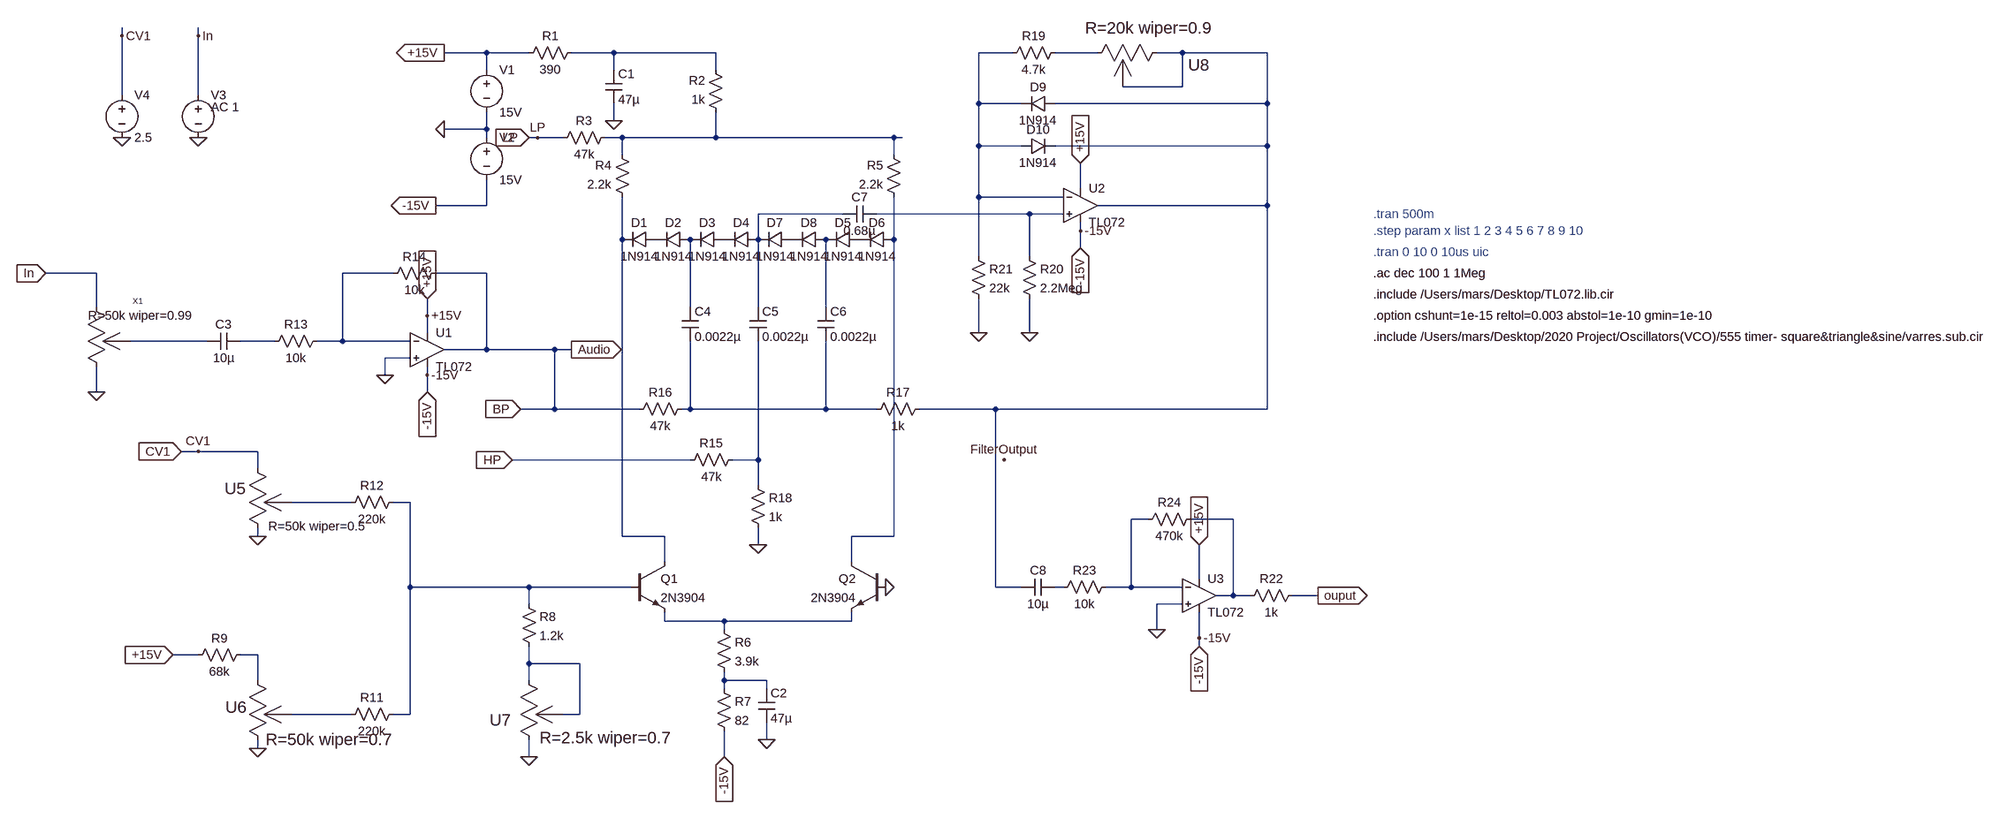
[diagram p0: schematic VCF.asc]
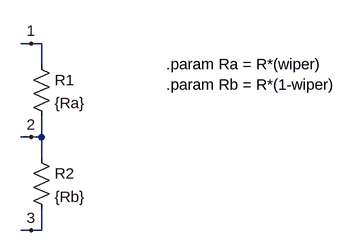
[diagram p1: sub-circuit varres.asc]
VCF.asc, the LTspice schematic file:
Version 4
SHEET 1 3112 2688
WIRE -512 48 -512 32
WIRE -368 48 -368 32
WIRE 176 80 96 80
WIRE 256 80 176 80
WIRE 416 80 336 80
WIRE 608 80 416 80
WIRE 1168 80 1104 80
WIRE 1328 80 1248 80
WIRE 1488 80 1440 80
WIRE 1648 80 1488 80
WIRE 176 112 176 80
WIRE 416 112 416 80
WIRE 608 112 608 80
WIRE 1488 144 1488 80
WIRE 1488 144 1376 144
WIRE -512 160 -512 48
WIRE -368 160 -368 48
WIRE 1104 176 1104 80
WIRE 1184 176 1104 176
WIRE 1648 176 1648 80
WIRE 1648 176 1248 176
WIRE 416 208 416 176
WIRE 176 224 176 192
WIRE 176 224 96 224
WIRE 176 240 176 224
WIRE 272 240 256 240
WIRE 320 240 272 240
WIRE 432 240 400 240
WIRE 608 240 608 192
WIRE 608 240 432 240
WIRE 944 240 608 240
WIRE 960 240 944 240
WIRE 1104 256 1104 176
WIRE 1184 256 1104 256
WIRE 1648 256 1648 176
WIRE 1648 256 1248 256
WIRE 432 272 432 240
WIRE 944 272 944 240
WIRE 1296 336 1296 288
WIRE 1104 352 1104 256
WIRE 1264 352 1104 352
WIRE 176 368 176 320
WIRE 176 368 80 368
WIRE 1648 368 1648 256
WIRE 1648 368 1328 368
WIRE 848 384 688 384
WIRE 1200 384 912 384
WIRE 1264 384 1200 384
WIRE 1296 416 1296 400
WIRE 432 432 432 352
WIRE 688 432 688 384
WIRE 944 432 944 352
WIRE 1296 448 1296 416
WIRE 1104 464 1104 352
WIRE 1200 464 1200 384
WIRE -560 496 -656 496
WIRE 0 496 -96 496
WIRE 176 496 80 496
WIRE -560 560 -560 496
WIRE 560 560 560 432
WIRE 688 560 688 432
WIRE 816 560 816 432
WIRE 64 576 64 544
WIRE 64 608 64 576
WIRE 1104 608 1104 544
WIRE 1200 608 1200 544
WIRE -352 624 -496 624
WIRE -224 624 -288 624
WIRE -96 624 -96 496
WIRE -96 624 -144 624
WIRE 32 624 -96 624
WIRE 176 640 176 496
WIRE 176 640 96 640
WIRE 304 640 176 640
WIRE 336 640 304 640
WIRE 32 656 -16 656
WIRE -16 688 -16 656
WIRE 64 688 64 672
WIRE -560 720 -560 672
WIRE 64 720 64 688
WIRE 304 752 304 640
WIRE 304 752 240 752
WIRE 464 752 304 752
WIRE 560 752 560 624
WIRE 560 752 544 752
WIRE 816 752 816 624
WIRE 816 752 560 752
WIRE 912 752 816 752
WIRE 1136 752 992 752
WIRE 1648 752 1648 368
WIRE 1648 752 1136 752
WIRE -368 832 -400 832
WIRE -256 832 -368 832
WIRE 560 848 224 848
WIRE 688 848 688 624
WIRE 688 848 640 848
WIRE -256 864 -256 832
WIRE 688 896 688 848
WIRE -80 928 -192 928
WIRE 32 928 0 928
WIRE 1424 960 1392 960
WIRE 1584 960 1504 960
WIRE -256 992 -256 976
WIRE 432 992 432 432
WIRE 512 992 432 992
WIRE 944 992 944 432
WIRE 944 992 864 992
WIRE 688 1008 688 976
WIRE 512 1040 512 992
WIRE 864 1040 864 992
WIRE 1520 1072 1520 1008
WIRE 32 1088 32 928
WIRE 256 1088 32 1088
WIRE 448 1088 256 1088
WIRE 1136 1088 1136 752
WIRE 1184 1088 1136 1088
WIRE 1264 1088 1248 1088
WIRE 1392 1088 1392 960
WIRE 1392 1088 1344 1088
WIRE 1488 1088 1392 1088
WIRE 1584 1104 1584 960
WIRE 1584 1104 1552 1104
WIRE 1616 1104 1584 1104
WIRE 1744 1104 1696 1104
WIRE 256 1120 256 1088
WIRE 1488 1120 1440 1120
WIRE 512 1152 512 1136
WIRE 624 1152 512 1152
WIRE 864 1152 864 1136
WIRE 864 1152 624 1152
WIRE 624 1168 624 1152
WIRE 1440 1168 1440 1120
WIRE 1520 1184 1520 1136
WIRE 1520 1200 1520 1184
WIRE -368 1216 -416 1216
WIRE -256 1216 -288 1216
WIRE 256 1232 256 1200
WIRE 352 1232 256 1232
WIRE -256 1264 -256 1216
WIRE 256 1264 256 1232
WIRE 624 1264 624 1248
WIRE 704 1264 624 1264
WIRE 624 1280 624 1264
WIRE 704 1280 704 1264
WIRE -80 1328 -192 1328
WIRE 32 1328 32 1088
WIRE 32 1328 0 1328
WIRE 352 1328 352 1232
WIRE 352 1328 320 1328
WIRE 704 1376 704 1344
WIRE -256 1392 -256 1376
WIRE 256 1408 256 1376
WIRE 624 1408 624 1360
FLAG 416 208 0
FLAG 96 224 0
FLAG 624 1408 -15V
IOPIN 624 1408 In
FLAG 704 1376 0
FLAG 928 1088 0
FLAG 256 1408 0
FLAG -256 992 0
FLAG -256 1392 0
FLAG -416 1216 +15V
IOPIN -416 1216 In
FLAG -368 832 CV1
FLAG -16 688 0
FLAG -656 496 In
IOPIN -656 496 In
FLAG -560 720 0
FLAG 64 576 +15V
FLAG 64 688 -15V
FLAG 336 640 Audio
IOPIN 336 640 Out
FLAG 272 240 LP
FLAG 688 1008 0
FLAG 240 752 BP
IOPIN 240 752 In
FLAG 224 848 HP
IOPIN 224 848 In
FLAG 1104 608 0
FLAG 1200 608 0
FLAG 1744 1104 ouput
IOPIN 1744 1104 Out
FLAG 1440 1168 0
FLAG 1520 1184 -15V
FLAG 1520 1008 +15V
IOPIN 1520 1008 In
FLAG 1296 288 +15V
IOPIN 1296 288 In
FLAG 1296 416 -15V
FLAG 96 80 +15V
IOPIN 96 80 Out
FLAG 80 368 -15V
IOPIN 80 368 Out
FLAG 64 544 +15V
IOPIN 64 544 In
FLAG 64 720 -15V
IOPIN 64 720 In
FLAG -400 832 CV1
IOPIN -400 832 In
FLAG 1520 1200 -15V
IOPIN 1520 1200 In
FLAG 1296 448 -15V
IOPIN 1296 448 In
FLAG -368 240 0
FLAG -368 48 In
FLAG -512 240 0
FLAG -512 48 CV1
FLAG 256 240 LP
IOPIN 256 240 In
FLAG 1152 848 FilterOutput
DATAFLAG 272 1088 "$"
DATAFLAG 592 240 "$"
DATAFLAG 944 992 "$"
DATAFLAG 432 992 "$"
SYMBOL voltage 176 96 R0
SYMATTR InstName V1
SYMATTR Value 15V
SYMBOL voltage 176 224 R0
SYMATTR InstName V2
SYMATTR Value 15V
SYMBOL res 352 64 R90
WINDOW 0 0 56 VBottom 2
WINDOW 3 32 56 VTop 2
SYMATTR InstName R1
SYMATTR Value 390
SYMBOL res 624 208 R180
WINDOW 0 36 76 Left 2
WINDOW 3 36 40 Left 2
SYMATTR InstName R2
SYMATTR Value 1k
SYMBOL cap 400 112 R0
SYMATTR InstName C1
SYMATTR Value 47µ
SYMBOL res 416 224 R90
WINDOW 0 0 56 VBottom 2
WINDOW 3 32 56 VTop 2
SYMATTR InstName R3
SYMATTR Value 47k
SYMBOL res 448 368 R180
WINDOW 0 36 76 Left 2
WINDOW 3 36 40 Left 2
SYMATTR InstName R4
SYMATTR Value 2.2k
SYMBOL res 960 368 R180
WINDOW 0 36 76 Left 2
WINDOW 3 36 40 Left 2
SYMATTR InstName R5
SYMATTR Value 2.2k
SYMBOL diode 496 416 R90
WINDOW 0 0 32 VBottom 2
WINDOW 3 32 32 VTop 2
SYMATTR InstName D1
SYMATTR Value 1N914
SYMBOL diode 560 416 R90
WINDOW 0 0 32 VBottom 2
WINDOW 3 32 32 VTop 2
SYMATTR InstName D2
SYMATTR Value 1N914
SYMBOL diode 624 416 R90
WINDOW 0 0 32 VBottom 2
WINDOW 3 32 32 VTop 2
SYMATTR InstName D3
SYMATTR Value 1N914
SYMBOL diode 688 416 R90
WINDOW 0 0 32 VBottom 2
WINDOW 3 32 32 VTop 2
SYMATTR InstName D4
SYMATTR Value 1N914
SYMBOL diode 880 416 R90
WINDOW 0 0 32 VBottom 2
WINDOW 3 32 32 VTop 2
SYMATTR InstName D5
SYMATTR Value 1N914
SYMBOL diode 944 416 R90
WINDOW 0 0 32 VBottom 2
WINDOW 3 32 32 VTop 2
SYMATTR InstName D6
SYMATTR Value 1N914
SYMBOL npn 448 1040 R0
SYMATTR InstName Q1
SYMATTR Value 2N3904
SYMBOL npn 928 1040 M0
SYMATTR InstName Q2
SYMATTR Value 2N3904
SYMBOL res 608 1152 R0
SYMATTR InstName R6
SYMATTR Value 3.9k
SYMBOL res 608 1264 R0
SYMATTR InstName R7
SYMATTR Value 82
SYMBOL cap 688 1280 R0
SYMATTR InstName C2
SYMATTR Value 47µ
SYMBOL res 240 1104 R0
SYMATTR InstName R8
SYMATTR Value 1.2k
SYMBOL res 16 1312 R90
WINDOW 0 0 56 VBottom 2
WINDOW 3 32 56 VTop 2
SYMATTR InstName R11
SYMATTR Value 220k
SYMBOL res 16 912 R90
WINDOW 0 0 56 VBottom 2
WINDOW 3 32 56 VTop 2
SYMATTR InstName R12
SYMATTR Value 220k
SYMBOL res -272 1200 R90
WINDOW 0 0 56 VBottom 2
WINDOW 3 32 56 VTop 2
SYMATTR InstName R9
SYMATTR Value 68k
SYMBOL res -128 608 R90
WINDOW 0 0 56 VBottom 2
WINDOW 3 32 56 VTop 2
SYMATTR InstName R13
SYMATTR Value 10k
SYMBOL res 96 480 R90
WINDOW 0 0 56 VBottom 2
WINDOW 3 32 56 VTop 2
SYMATTR InstName R14
SYMATTR Value 10k
SYMBOL cap -288 608 R90
WINDOW 0 0 32 VBottom 2
WINDOW 3 32 32 VTop 2
SYMATTR InstName C3
SYMATTR Value 10µ
SYMBOL diode 752 416 R90
WINDOW 0 0 32 VBottom 2
WINDOW 3 32 32 VTop 2
SYMATTR InstName D7
SYMATTR Value 1N914
SYMBOL diode 816 416 R90
WINDOW 0 0 32 VBottom 2
WINDOW 3 32 32 VTop 2
SYMATTR InstName D8
SYMATTR Value 1N914
SYMBOL res 656 832 R90
WINDOW 0 0 56 VBottom 2
WINDOW 3 32 56 VTop 2
SYMATTR InstName R15
SYMATTR Value 47k
SYMBOL res 560 736 R90
WINDOW 0 0 56 VBottom 2
WINDOW 3 32 56 VTop 2
SYMATTR InstName R16
SYMATTR Value 47k
SYMBOL cap 544 560 R0
SYMATTR InstName C4
SYMATTR Value 0.0022µ
SYMBOL cap 672 560 R0
SYMATTR InstName C5
SYMATTR Value 0.0022µ
SYMBOL cap 800 560 R0
SYMATTR InstName C6
SYMATTR Value 0.0022µ
SYMBOL res 1008 736 R90
WINDOW 0 0 56 VBottom 2
WINDOW 3 32 56 VTop 2
SYMATTR InstName R17
SYMATTR Value 1k
SYMBOL cap 912 368 R90
WINDOW 0 0 32 VBottom 2
WINDOW 3 32 32 VTop 2
SYMATTR InstName C7
SYMATTR Value 0.68µ
SYMBOL res 672 880 R0
SYMATTR InstName R18
SYMATTR Value 1k
SYMBOL diode 1248 160 R90
WINDOW 0 0 32 VBottom 2
WINDOW 3 32 32 VTop 2
SYMATTR InstName D9
SYMATTR Value 1N914
SYMBOL diode 1184 272 R270
WINDOW 0 32 32 VTop 2
WINDOW 3 0 32 VBottom 2
SYMATTR InstName D10
SYMATTR Value 1N914
SYMBOL res 1264 64 R90
WINDOW 0 0 56 VBottom 2
WINDOW 3 32 56 VTop 2
SYMATTR InstName R19
SYMATTR Value 4.7k
SYMBOL res 1184 448 R0
SYMATTR InstName R20
SYMATTR Value 2.2Meg
SYMBOL res 1088 448 R0
SYMATTR InstName R21
SYMATTR Value 22k
SYMBOL res 1712 1088 R90
WINDOW 0 0 56 VBottom 2
WINDOW 3 32 56 VTop 2
SYMATTR InstName R22
SYMATTR Value 1k
SYMBOL cap 1248 1072 R90
WINDOW 0 0 32 VBottom 2
WINDOW 3 32 32 VTop 2
SYMATTR InstName C8
SYMATTR Value 10µ
SYMBOL res 1360 1072 R90
WINDOW 0 0 56 VBottom 2
WINDOW 3 32 56 VTop 2
SYMATTR InstName R23
SYMATTR Value 10k
SYMBOL res 1520 944 R90
WINDOW 0 0 56 VBottom 2
WINDOW 3 32 56 VTop 2
SYMATTR InstName R24
SYMATTR Value 470k
SYMBOL Opamps/opamp2 1520 1040 R0
SYMATTR InstName U3
SYMATTR Value TL072
SYMBOL Opamps/opamp2 64 576 R0
SYMATTR InstName U1
SYMATTR Value TL072
SYMBOL Opamps/opamp2 1296 304 R0
SYMATTR InstName U2
SYMATTR Value TL072
SYMBOL voltage -368 144 R0
WINDOW 3 24 38 Left 2
SYMATTR Value AC 1
SYMATTR InstName V3
SYMATTR Value2 AC 3
SYMBOL voltage -512 144 R0
SYMATTR InstName V4
SYMATTR Value 2.5
SYMBOL varres 1424 64 R90
WINDOW 3 -31 -125 VRight 3
WINDOW 0 39 -116 VRight 3
SYMATTR Value R=20k wiper=0.9
SYMATTR InstName U8
SYMBOL varres -272 880 R0
WINDOW 3 36 93 Left 2
WINDOW 0 -46 22 Left 3
SYMATTR Value R=50k wiper=0.5
SYMATTR InstName U5
SYMBOL varres -272 1280 R0
WINDOW 3 31 96 Left 3
WINDOW 0 -45 35 Left 3
SYMATTR Value R=50k wiper=0.7
SYMATTR InstName U6
SYMBOL varres 240 1280 R0
WINDOW 3 36 92 Left 3
WINDOW 0 -58 59 Left 3
SYMATTR Value R=2.5k wiper=0.7
SYMATTR InstName U7
SYMBOL varres -576 576 R0
WINDOW 3 0 0 Left 2
SYMATTR Value R=50k wiper=0.99
SYMATTR InstName X1
TEXT 1848 496 Left 2 !.ac dec 100 1 1Meg
TEXT 1848 536 Left 2 !.include /Users/mars/Desktop/TL072.lib.cir
TEXT 1848 456 Left 2 ;.tran 0 10 0 10us uic
TEXT 1848 416 Left 2 ;.step param x list 1 2 3 4 5 6 7 8 9 10
TEXT 1848 576 Left 2 !.option cshunt=1e-15 reltol=0.003 abstol=1e-10 gmin=1e-10
TEXT 1848 616 Left 2 !.include /Users/mars/Desktop/2020 Project/Oscillators(VCO)/555 timer- square&triangle&sine/varres.sub.cir
TEXT 1848 384 Left 2 ;.tran 500m

varres.asc, the sub-circuit schematic file:
Version 4
SHEET 1 892 680
WIRE 368 144 352 144
WIRE 384 144 368 144
WIRE 384 176 384 144
WIRE 368 288 352 288
WIRE 384 288 384 256
WIRE 384 288 368 288
WIRE 384 320 384 288
WIRE 368 432 352 432
WIRE 384 432 384 400
WIRE 384 432 368 432
FLAG 368 144 1
FLAG 368 288 2
FLAG 368 432 3
SYMBOL res 368 160 R0
SYMATTR InstName R1
SYMATTR Value {Ra}
SYMBOL res 368 304 R0
SYMATTR InstName R2
SYMATTR Value {Rb}
TEXT 576 176 Left 2 !.param Ra = R*(wiper)\n.param Rb = R*(1-wiper)

The netlist it stands for:
* VCF.asc
V1 +15V 0 15V
V2 0 -15V 15V
R1 N001 +15V 390
R2 N005 N001 1k
C1 N001 0 47µ
R3 N005 LP 47k
R4 N008 N005 2.2k
R5 N009 N005 2.2k
D1 P001 N008 1N914
D2 N011 P001 1N914
D3 P002 N011 1N914
D4 N006 P002 1N914
D5 P003 N012 1N914
D6 N009 P003 1N914
Q1 N008 N018 N022 0 2N3904
Q2 N009 0 N022 0 2N3904
R6 N022 N025 3.9k
R7 N025 -15V 82
C2 N025 0 47µ
R8 N018 N024 1.2k
R11 N018 N026 220k
R12 N018 N017 220k
R9 N023 +15V 68k
R13 N010 N014 10k
R14 BP N010 10k
C3 N014 N013 10µ
D7 P004 N006 1N914
D8 N012 P004 1N914
R15 N016 HP 47k
R16 N015 BP 47k
C4 N011 N015 0.0022µ
C5 N006 N016 0.0022µ
C6 N012 N015 0.0022µ
R17 N004 N015 1k
C7 N007 N006 0.68µ
R18 N016 0 1k
D9 N004 N002 1N914
D10 N002 N004 1N914
R19 N003 N002 4.7k
R20 N007 0 2.2Meg
R21 N002 0 22k
R22 ouput N020 1k
C8 N021 N004 10µ
R23 N019 N021 10k
R24 N020 N019 470k
XU3 0 N019 +15V -15V N020 TL072  ; pins In+ In- V+ V- OUT
XU1 0 N010 +15V -15V BP TL072  ; pins In+ In- V+ V- OUT
XU2 N007 N002 +15V -15V N004 TL072  ; pins In+ In- V+ V- OUT
V3 In 0 AC 1 AC 3
V4 CV1 0 2.5
XU8 N003 N004 N004 varres params: R=20k wiper=0.9
XU5 0 N017 CV1 varres params: R=50k wiper=0.5
XU6 0 N026 N023 varres params: R=50k wiper=0.7
XU7 0 N024 N024 varres params: R=2.5k wiper=0.7
XX1 0 N013 In varres params: R=50k wiper=0.99

* block symbol definitions
.subckt varres 3 2 1
R1 1 2 {Ra}
R2 2 3 {Rb}
.param Ra = R*(wiper)
.param Rb = R*(1-wiper)
.ends varres

.model D D
.lib standard.dio
.model NPN NPN
.model PNP PNP
.lib standard.bjt
.ac dec 100 1 1Meg
.include /Users/mars/Desktop/TL072.lib.cir
* .tran 0 10 0 10us uic
* .step param x list 1 2 3 4 5 6 7 8 9 10
.option cshunt=1e-15 reltol=0.003 abstol=1e-10 gmin=1e-10
.include /Users/mars/Desktop/2020 Project/Oscillators(VCO)/555 timer- square&triangle&sine/varres.sub.cir
* .tran 500m
.backanno
.end